# Altium project AirReader.PrjPcb
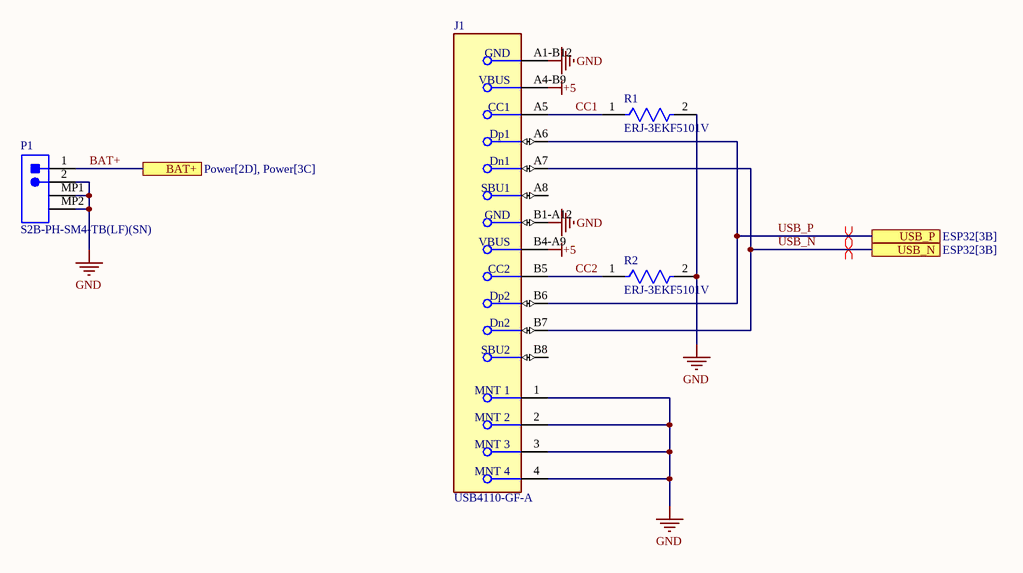
[diagram p0: Connectors.SchDoc]
5 sheets, 56 parts. Net scope: flat (ports and power ports of the same name join across sheets).
Board file: AirReader.PcbDoc
Sheets:
  Connectors.SchDoc
  PN532.SchDoc
  Power.SchDoc
  ESP32.SchDoc
  Peripherals.SchDoc

## Sheet Connectors.SchDoc
size A; SheetNumber: 1; SheetTotal: 5

### Parts
J1  USB4110-GF-A  [FP-USB4110-GF-A-MFG]
P1  S2B-PH-SM4-TB(LF)(SN)  [JST- S2B-PH-SM4-TB(LF)(SN)-2_V]
R1  ERJ-3EKF5101V  [FP-ERJ3EK-MFG]
R2  ERJ-3EKF5101V  [FP-ERJ3EK-MFG]

### Ports
BAT+ (see Power[2D], Power[3C]), USB_N (see ESP32[3B]), USB_P (see ESP32[3B])

### Nets
+5: J1.A4-B9(VBUS) J1.B4-A9(VBUS)
GND: J1.1(MNT_1) J1.2(MNT_2) J1.3(MNT_3) J1.4(MNT_4) J1.A1-B12(GND) J1.B1-A12(GND) P1.2 P1.MP1 P1.MP2 R1.2 R2.2
BAT+: P1.1 ; port BAT+
CC1: J1.A5(CC1) R1.1
CC2: J1.B5(CC2) R2.1
USB_N: J1.A7(Dn1) J1.B7(Dn2) ; port USB_N
USB_P: J1.A6(Dp1) J1.B6(Dp2) ; port USB_P

Not connected (* = marked no-connect by the designer): J1 A8(SBU1) B8(SBU2)

### Layout directives
differential pair: USB_N, USB_P

### Library data of the parts
J1 = CMP-245163-000002-1: CONN USB 2.0 TYPE-C R/A SMT; Manufacturer: GCT; Conn Orientation: Right Angle; Usb Standard: USB 2.0; Voltage Rating: 20V; Current Rating: 3/4.25/1.25/0.25A; Number Of Contacts: 16; Is Female: yes; Shielding: true; Standoff Height: 0.1mm; Octopart: https://octopart.com/usb4110-gf-a-gct-103941985; Temperature: -40°C to +85°C; RoHS: TRUE; Automotive: No; Contact Material: Gold,Nickel; Device Class L1: Connectors; Device Class L2: USB Connectors; Package: 0; Lead Free: Yes; ComponentLink2URL: https://gct.co/files/drawings/usb4110.pdf; Temperature Range High: +85°C; Temperature Range Low: -40°C; Height: 3.46mm; Manufacturer Part Number: USB4110-GF-A; ComponentLink2Description: Datasheet; Device Class L3: unset; Digikey Description: CONN USB 2.0 TYPE-C R/A SMT; Category: Conn
P1 = CMP-1755-00001-1: Male Header, Pitch 2 mm, 1 x 2 Position, Height 5.5 mm, -25 to 85 degC, RoHS, Tape and Reel; Current Rating: 3 A; ComponentLink1URL: http://www.jst.com/home2.html; Radiation Hardening: No; RoHSCompliant: True; Mount: Through Hole; Contact Material: Bronze; Package Quantity: 100; Width: 2.34 mm; DatasheetVersion: Dec-12; Height: 8.13 mm; Max Operating Temperature: 105degC; ComponentLink2Description: Datasheet; Lead Pitch: 0.1 inch; Contact Finish: Lead; Packaging: Bulk; Colour: Black; Contact Plating: Tin; Min Operating Temperature: -65degC; ComponentLink1Description: Manufacturer URL; PackageReference: S2B-PH-SM4-TB(LF)(SN)-2; PackageDescription: Male Header, Pitch 2 mm, 1 x 2 Position, Height 5.5 mm; ComponentLink2URL: http://www.jst-mfg.com/product/pdf/eng/ePH.pdf; Pins: 40; Length: 101.19 mm
R1 R2 = CMP-2000-00540-8: RES SMD 5.1K OHM 1% 1/10W 0603; Power Rating: 100mW; Temperature Coefficient: 100ppm/°C; Voltage Rating: 75V; Resistance: 5.1kR; Military Standard: Not; Case/Package: 0603; Packaging: Tape and Reel; Package Quantity: 1; Reach SVHC Compliant: Yes; Lead Free: Lead Free; Mount: Surface Mount; Size Code: 0603; Depth: 0.8mm; Resistance Tolerance: 1%; Number of Terminations: 2; Resistor Type: Thick Film; Width: 0.8mm; Construction: Rectangular; Series: ERJ; Radiation Hardening: No; Max Operating Temperature: 155°C; Features: Automotive AEC-Q200; Tolerance: 1%; Voltage Rating (DC): 75V; Length: 1.6mm; RoHS Compliant: Yes; Min Operating Temperature: -55°C; Case Code (Metric): 1608; Termination: SMD/SMT; Weight: 7.1E-05oz; Max Power Dissipation: 100mW; Contact Plating: Tin; Height: 0.022inch; Case Code (Imperial): 0603

## Sheet PN532.SchDoc
size A; SheetNumber: 2; SheetTotal: 5
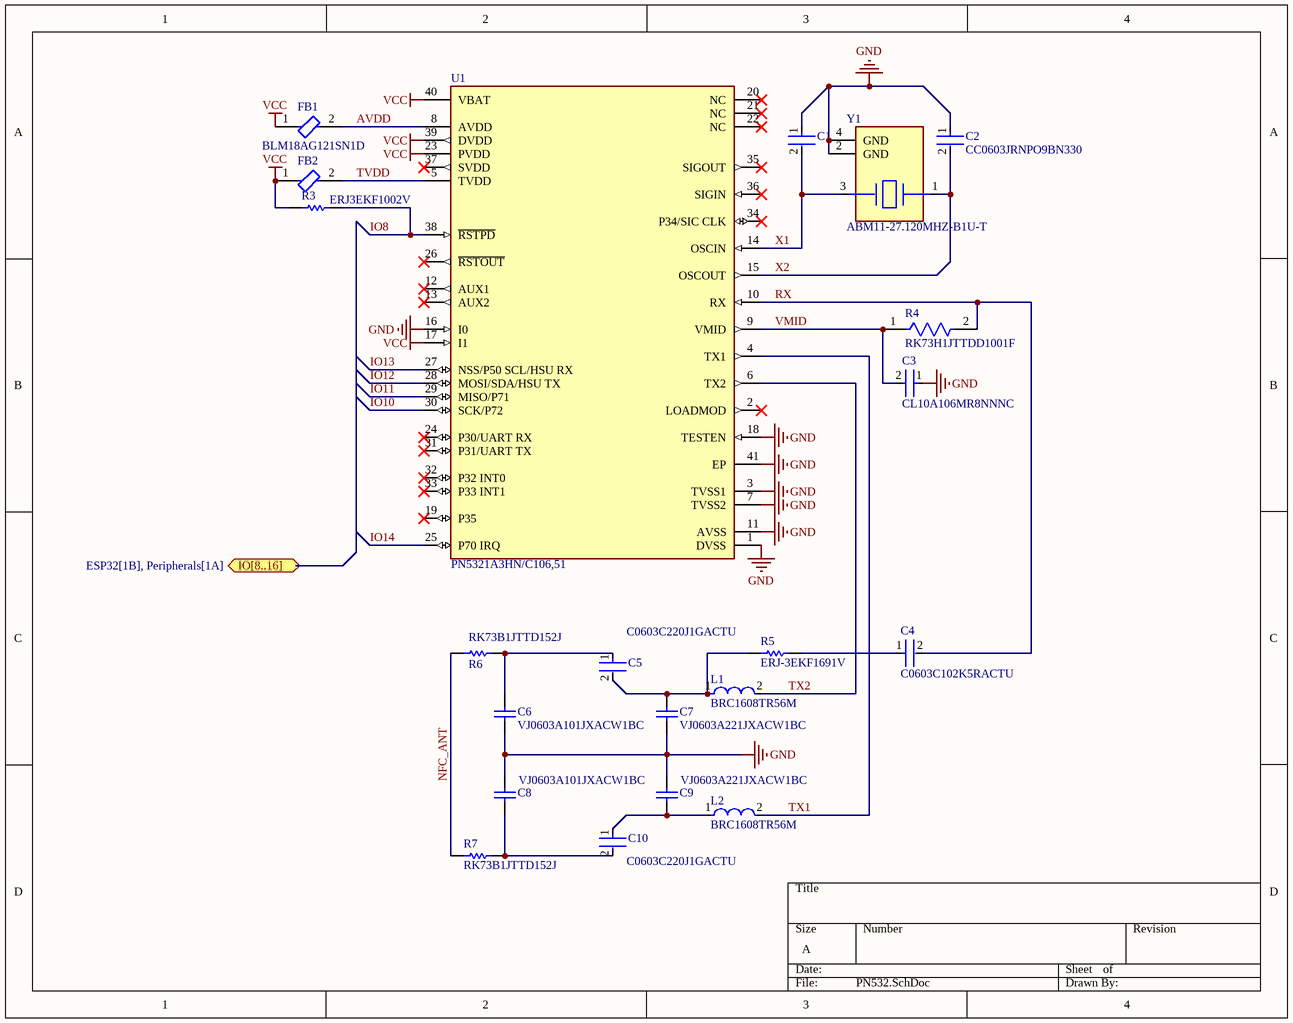
[diagram p1: PN532.SchDoc]

### Parts
C1  CC0603JRNPO9BN330  [FP-CC0603-0_9-IPC_C]  (value not drawn)
C2  CC0603JRNPO9BN330  [FP-CC0603-0_9-IPC_C]
C3  CL10A106MR8NNNC  [FP-CL10-IPC_C]
C4  C0603C102K5RACTU  [FP-C0603C-CF-MFG]
C5  C0603C220J1GACTU  [FP-C0603C-CF-MFG]
C6  VJ0603A101JXACW1BC  [CAPC1608X95X40ML15T15]
C7  VJ0603A221JXACW1BC  [CAPC1608X95X40ML15T15]
C8  VJ0603A101JXACW1BC  [CAPC1608X95X40ML15T15]
C9  VJ0603A221JXACW1BC  [CAPC1608X95X40ML15T15]
C10  C0603C220J1GACTU  [FP-C0603C-CF-MFG]
FB1  BLM18AG121SN1D  [FP-BLM18-0_15-t0_8-IPC_B]
FB2  BLM18AG121SN1D  [FP-BLM18-0_15-t0_8-IPC_B]  (value not drawn)
L1  BRC1608TR56M  [FP-BRC1608-MFG]
L2  BRC1608TR56M  [FP-BRC1608-MFG]
R3  ERJ3EKF1002V  [RESC1609X55X30LL15T15]
R4  RK73H1JTTDD1001F  [FP-RK73H1J-IPC_A]
R5  ERJ-3EKF1691V  [RESC1608X55X30NL15T15]
R6  RK73B1JTTD152J  [RESC1608X55X30LL20T10]
R7  RK73B1JTTD152J  [RESC1608X55X30LL20T10]
U1  PN5321A3HN/C106,51  [FP-SOT618-1-MFG]
Y1  ABM11-27.120MHZ-B1U-T  [FP-ABM11-MFG]

### Ports
IO[8..16] (bidir, see ESP32[1B], Peripherals[1A])

### Nets
GND: C1.1 C2.1 C3.1 C6.1 C7.1 C8.2 C9.2 U1.1(DVSS) U1.3(TVSS1) U1.7(TVSS2) U1.11(AVSS) U1.16(I0) U1.18(TESTEN) U1.41(EP) Y1.2(GND) Y1.4(GND)
VCC: FB1.1 FB2.1 R3.2 U1.17(I1) U1.23(PVDD) U1.39(DVDD) U1.40(VBAT)
AVDD: FB1.2 U1.8(AVDD)
IO8: R3.1 U1.38(~{RSTPD})
IO10: U1.30(SCK/P72)
IO11: U1.29(MISO/P71)
IO12: U1.28(MOSI/SDA/HSU_TX)
IO13: U1.27(NSS/P50_SCL/HSU_RX)
IO14: U1.25(P70_IRQ)
NFC_ANT: R6.1 R7.1
RX: C4.2 R4.2 U1.10(RX)
TVDD: FB2.2 U1.5(TVDD)
TX1: L2.2 U1.4(TX1)
TX2: L1.2 U1.6(TX2)
VMID: C3.2 R4.1 U1.9(VMID)
X1: C1.2 U1.14(OSCIN) Y1.3
X2: C2.2 U1.15(OSCOUT) Y1.1
NetC4_1: C4.1 R5.1
NetC5_1: C5.1 C6.2 R6.2
NetC5_2: C5.2 C7.2 L1.1 R5.2
NetC8_1: C8.1 C10.2 R7.2
NetC9_1: C9.1 C10.1 L2.1

Not connected (* = marked no-connect by the designer): U1 2(LOADMOD)* 12(AUX1)* 13(AUX2)* 19(P35)* 20(NC)* 21(NC)* 22(NC)* 24(P30/UART_RX)* 26(~{RSTOUT})* 31(P31/UART_TX)* 32(P32_INT0)* 33(P33_INT1)* 34(P34/SIC_CLK)* 35(SIGOUT)* 36(SIGIN)* 37(SVDD)*

### Library data of the parts
C1 C2 = CMP-2000-06072-2: CAP CER 33PF 50V C0G/NPO 0603; Tolerance: 5%; Temperature Coefficient: 30ppm/°C; Dielectric: C0G; Insulation Resistance: 100GR; Dielectric Material: Ceramic; Voltage Rating (DC): 50V; Capacitance: 33pF; Voltage: 50V; Resistor Type: Ceramic; Lead Free: Lead Free; Mount: Surface Mount; Case Code (Imperial): 0603; Min Operating Temperature: -55°C; Package Quantity: 1; Case Code (Metric): 1608; Radiation Hardening: No; Packaging: Tape and Reel; Length: 1.6mm; Width: 0.031inch; Termination: SMD/SMT; Max Operating Temperature: 125°C; Series: CC; Case/Package: 0603; RoHS Compliant: Yes; Number of Pins: 2; REACH SVHC: No SVHC; Thickness: 0.035inch; Depth: 0.8mm; Voltage Rating: 50V; Height: 0.8mm
C3 = CMP-13271-001990-1: Cap Ceramic 10uF 4V X5R ±20% Pad SMD 0603 +85°C T/R; Thickness: 0.035inch; Dielectric: X5R; Lead Free: Lead Free; Case Code (Imperial): 0603; Height: 0.8mm; Case Code (Metric): 1608; Voltage Rating (DC): 4V; Length: 1.6mm; Voltage Rating: 4V; Min Operating Temperature: -55°C; Depth: 0.8mm; Mount: Surface Mount; Radiation Hardening: No; Case/Package: 0603; Package Quantity: 1; Packaging: Tape and Reel; Width: 0.031inch; Tolerance: 20%; Max Operating Temperature: 85°C; Capacitance: 10uF
C4 = CMP-2006-03022-3: CAP CER 1000PF 50V X7R 0603; Manufacturer: KEMET; Automotive Grade: Grade 1; Tolerance: 0.1; Value: 1,000 pF; Temperature Coefficient: 30ppm/°C; Material: Ceramic; Temperature Characteristic: X7R; ComponentLink2URL: https://api.kemet.com/component-edge/download/datasheet/C0603C100J5GACAUTO.pdf; Temperature Range Low: -55°C; Capacitance: 1,000 pF; Device Class L2: Capacitors; Device Class L3: Ceramic Capacitors; Device Class L1: Passive Components; Temperature Range High: +125°C; Manufacturer Part Number: C0603C102K5RACTU; Digikey Description: CAP CER 1000PF 50V X7R 0603; Temperature: -55°C to +125°C; Voltage Rating: 50 V; Mouser Description: Capacitor; Ceramic; Cap; 1000pF; Tol 10%; SMT; Vol-Rtg 50V; X7R; Tape and Reel; Automotive: Yes; RoHS: TRUE; Octopart: https://octopart.com/c0603c102k5ractu-kemet-144878; Height: 0.87mm; Package: C0603C-CF; Lead Free: Yes; Category: Cap; ComponentLink2Description: Datasheet
C5 C10 = CMP-2006-03322-2: CAP CER 22PF 100V 5% NP0 0603; Manufacturer: KEMET; Material: Ceramic; Automotive Grade: Grade 1; Temperature Characteristic: C0G; Temperature Coefficient: 30ppm/°C; Tolerance: 0.05; Temperature Range High: +125°C; Capacitance: 22 pF; ComponentLink2URL: https://api.kemet.com/component-edge/download/datasheet/C0603C100J5GACAUTO.pdf; Package: C0603C-CF; Category: Cap; Voltage Rating: 100 V; Automotive: Yes; Mouser Description: Multilayer Ceramic Capacitors MLCC - SMD/SMT 100volts 22pF C0G 5%; Device Class L1: Passive Components; Device Class L3: Ceramic Capacitors; Temperature: -55°C to +125°C; Digikey Description: CAP CER 22PF 100V 5% NP0 0603; RoHS: TRUE; Value: 22 pF; ComponentLink2Description: Datasheet; Height: 0.87mm; Temperature Range Low: -55°C; Manufacturer Part Number: C0603C220J1GACTU; Device Class L2: Capacitors; Octopart: https://octopart.com/c0603c220j1gactu-kemet-9142653; Lead Free: Yes
C6 C8 = CMP-2006-01530-1: Manufacturer: Vitramon; Part Number: VJ0603A101JXACW1BC
C7 C9 = CMP-2006-00030-1: Manufacturer: Vitramon; Part Number: VJ0603A221JXACW1BC
FB1 FB2 = CMP-0686-00439-3: Chip Ferrite Bead, 0603, 120Ω @ 100MHz, 0.18Ω, 25%, 800mA; DC Resistance (DCR): 180mR; Number of Lines: 1; Current Rating: 500mA; Material: Steel; Impedance: 120R; Shielding: Unshielded; Case/Package: 0603; Max Operating Temperature: 125°C; Min Operating Temperature: -55°C; Series: BLM18A; Case Code (Metric): 1608; DC Resistance-Max: 180mR; Package Quantity: 1; Core Material: Ferrite; Radiation Hardening: No; Length: 1.6mm; Lead Free: Lead Free; Max DC Current: 500mA; Termination: SMD/SMT; Number of Pins: 2; Tolerance: 25%; Military Standard: Not; REACH SVHC: No SVHC; Number of Circuits: 1; Test Frequency: 100MHz; Max Current Rating: 500mA; Depth: 0.8mm; Frequency: 100MHz; Width: 0.8mm; Case Code (Imperial): 0603; DC Current: 500mA; Height: 0.8mm; RoHS Compliant: Yes; Packaging: Tape and Reel
L1 L2 = CMP-14484-000012-1: FIXED IND 560NH 760MA 95 MOHM; Tolerance: 20%; Shielding: Unshielded; Test Frequency: 7.96MHz; Self Resonant Frequency: 170MHz; DC Resistance (DCR): 95mR; Core Material: Ferrite; Saturation Current: 1.15A; Inductance Tolerance: 20%; Case Code (Imperial): 0603; Inductance: 560nH; Mount: Surface Mount; Min Operating Temperature: -40°C; Height - Seated (Max): 0.039inch; Halogen Free: Halogen Free; Radiation Hardening: No; REACH SVHC: No SVHC; Termination: SMD/SMT; Height: 0.8mm; Case/Package: 0603; Number of Pins: 2; Package Quantity: 3000; Packaging: Tape and Reel; Current Rating: 760mA; Military Standard: Not; Depth: 1mm; Max DC Current: 760mA; Composition: Wirewound; Max Operating Temperature: 105°C; Case Code (Metric): 1608; Length: 1.6mm; Width: 0.031inch; DC Current: 760mA
R3 = CMP-1012-00623-3: Chip Resistor, 10 KOhm, +/- 1%, 0.1 W, -55 to 155 degC, 0603 (1608 Metric), RoHS, Tape and Reel; Manufacturer: Panasonic; Voltage Rating: 75V; Case\/Package: 0603; Power Rating: 100mW; Resistance: 10KOhm; Temperature Coefficient: 100ppm\/degreesC; Number of Pins: 2; Package Reference: 603; Depth: 0.8mm; Mount: SurfaceMount; Package Description: 2-Pin Surface Mount Device, Body 1.6 x 0.85 mm; Datasheet Version: 02/2017; Length: 1.6mm; Lead Free: LeadFree; Height: 0.45mm; Number of Terminations: 2; Max Power Dissipation: 100mW; Min Operating Temperature: -55degC; Datasheet URL: https://industrial.panasonic.com/cdbs/www-data/pdf/RDA0000/AOA0000C304.pdf; Termination: SMD/SMT; Case Code (Metric): 1608; Case Code (Imperial): 0603; Tolerance: 1%; Max Operating Temperature: 155degC; RoHSCompliant: true; Voltage Rating (DC): 75V; Radiation Hardening: No; Packaging: TapeandReel; Composition: ThickFilm; Mounting Technology: SurfaceMount; Manufacturer URL: http://www.panasonic.com/; Width: 0.031inch; REACH SVHC: NoSVHC; Contact Plating: Tin; Military Standard: Not; Package Quantity: 1
R4 = CMP-2000-01750-2: 1kΩ ±1% 0.125W Chip Resistor 0603 Thick Film AEC-Q200 Qualified; Power Rating: 100mW; Temperature Coefficient: 100ppm/°C; Voltage Rating: 50V; Resistance: 1kR; Max Operating Temperature: 155°C; Min Operating Temperature: -55°C; Depth: 0.8mm; Case/Package: 0603; Length: 1.6mm; Package Quantity: 10000; Construction: Rectangular; Resistor Type: Thick Film; Lead Free: Lead Free; RoHS Compliant: Yes; Military Standard: Not; Case Code (Metric): 1608; Termination: SMD/SMT; Packaging: Tape and Reel; Tolerance: 1%; Width: 0.8mm; Series: RK73H; Case Code (Imperial): 0603; Height: 0.45mm
R5 = CMP-1012-00534-2: Manufacturer: Panasonic; Part Number: ERJ-3EKF1691V
R6 R7 = CMP-2000-01875-1: Manufacturer: KOA Speer; Part Number: RK73B1JTTD152J
U1 = CMP-10150-000009-1: IC RFID RDR/TRAN 13.56MZ 40HVQFN; Manufacturer: NXP Semiconductors; Max Power Dissipation: 500mW; Transmitting Current: 60mA; Data Rate: 424kbits/s; Max Junction Temp: +125°C; Standoff Height: 0mm; Nominal Supply Current: 0.5-60mA; Interface: I2C,SPI,UART; Number Of Adc Channels: 2; Max Frequency: 13.56MHz; Number Of Gpio: 9; Min Supply Voltage: 1.6V; Max Supply Voltage: 5.5V; RoHS: TRUE; Ambient Temperature Range High: +85°C; Temperature Range High: +125°C; Lead Free: Yes; Package: SOT618-1; Temperature Range Low: -40°C; Device Class L1: Integrated Circuits (ICs); Digikey Description: IC RFID RDR/TRAN 13.56MZ 40HVQFN; Octopart: https://octopart.com/pn5321a3hn%2Fc106%2C51-nxp+semiconductors-18453768; Device Class L3: Transceivers; Temperature: -40°C to +125°C; Ipc Land Pattern Name: QFN50P600X600X85-40; Device Class L2: RF Semiconductors and Devices; Footprint Url: https://www.nxp.com/docs/en/package-information/SOT618-1.pdf; Automotive: No; ComponentLink2Description: Datasheet; ComponentLink2URL: https://www.nxp.com/docs/en/nxp/data-sheets/PN532_C1.pdf; Category: IC; Height: 1mm; Mouser Description: PN5321A3HN Series 13.56 MHz RF Reader Analog and Digital Combo - HVQFN-40; Manufacturer Part Number: PN5321A3HN/C106,51; Ambient Temperature Range Low: -30°C
Y1 = CMP-27762-005978-1: Crystal 27.12MHz ±10ppm 10pF SMD-4 2mm x 1.6mm

## Sheet Power.SchDoc
size A; SheetNumber: 3; SheetTotal: 5
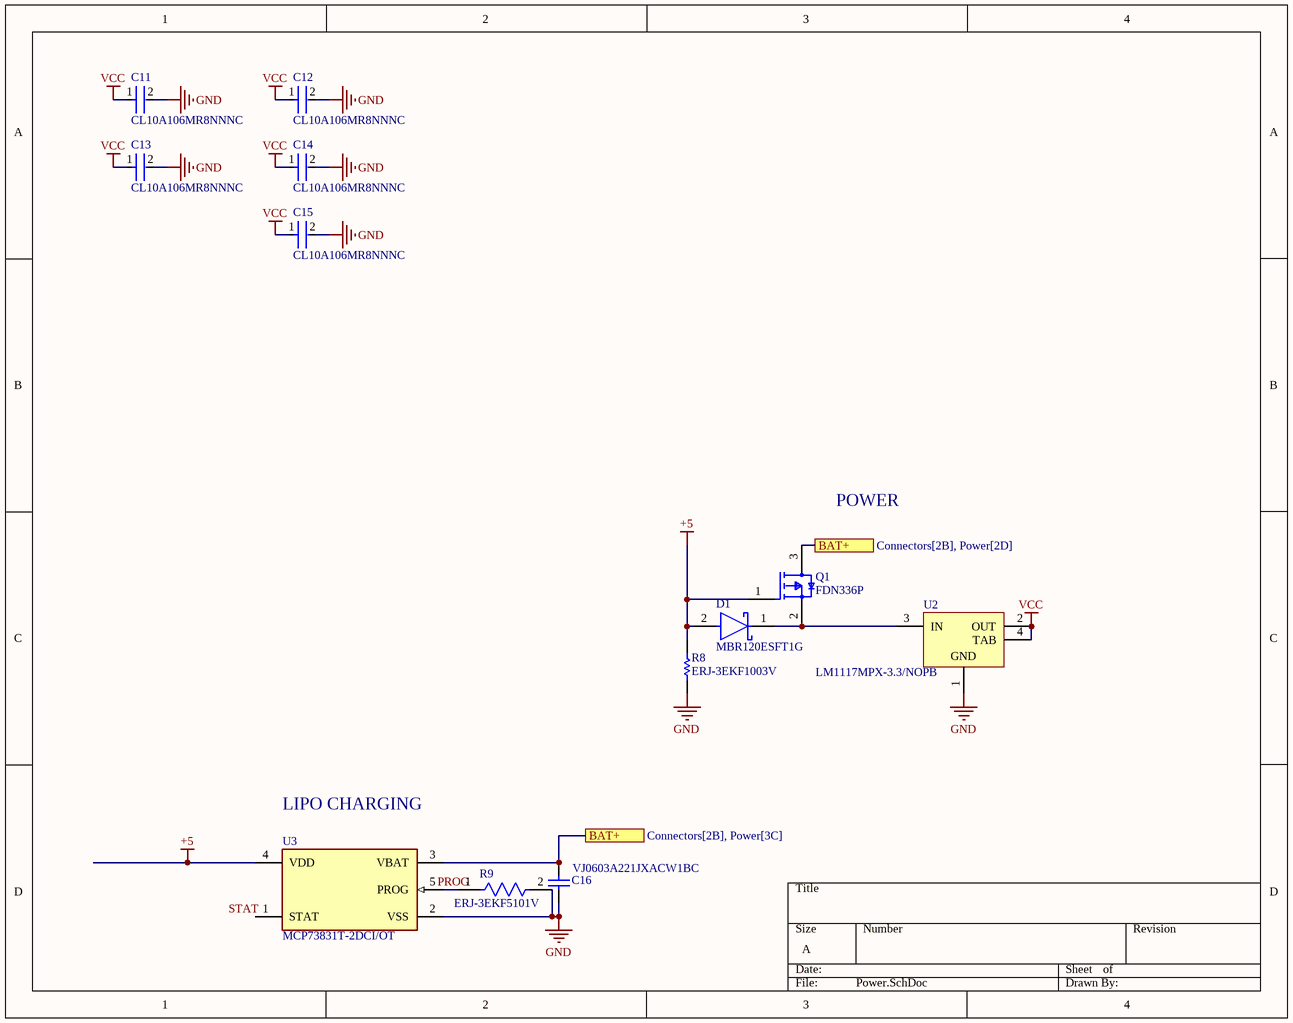
[diagram p2: Power.SchDoc]

### Parts
C11  CL10A106MR8NNNC  [FP-CL10-IPC_C]
C12  CL10A106MR8NNNC  [FP-CL10-IPC_C]
C13  CL10A106MR8NNNC  [FP-CL10-IPC_C]
C14  CL10A106MR8NNNC  [FP-CL10-IPC_C]
C15  CL10A106MR8NNNC  [FP-CL10-IPC_C]
C16  VJ0603A221JXACW1BC  [CAPC1608X95X40ML15T15]
D1  MBR120ESFT1G  [On_Semiconductor_498_MFG]
Q1  FDN336P  [FP-527AG-IPC_A]
R8  ERJ-3EKF1003V  [RESC1608X55X30ML15T15]
R9  ERJ-3EKF5101V  [FP-ERJ3EK-MFG]
U2  LM1117MPX-3.3/NOPB  [DCY0004A_L]
U3  MCP73831T-2DCI/OT  [FP-C04-091-OT-IPC_B]

### Ports
BAT+ (see Connectors[2B], Power[2D]), BAT+ (see Connectors[2B], Power[3C])

### Nets
+5: D1.2(A) Q1.1(G) R8.2 U3.4(VDD)
GND: C11.2 C12.2 C13.2 C14.2 C15.2 C16.1 R8.1 R9.2 U2.1(GND) U3.2(VSS)
VCC: C11.1 C12.1 C13.1 C14.1 C15.1 U2.2(OUT) U2.4(TAB)
BAT+: C16.2 Q1.3(D) U3.3(VBAT) ; port BAT+
NetD1_1: D1.1(C) Q1.2(S) U2.3(IN)
NetR9_1: R9.1 U3.5(PROG)

Not connected (* = marked no-connect by the designer): U3 1(STAT)

### Notes on the sheet
- POWER
- (near U3) LIPO CHARGING
- Labels drawn without touching a wire or pin: PROG, STAT

### Library data of the parts
C11-C15 = CMP-13271-001990-1: as C3 on sheet PN532; Thickness: 0.035inch; Dielectric: X5R; Lead Free: Lead Free; Case Code (Imperial): 0603; Height: 0.8mm; Case Code (Metric): 1608; Voltage Rating (DC): 4V; Length: 1.6mm; Voltage Rating: 4V; Min Operating Temperature: -55°C; Depth: 0.8mm; Mount: Surface Mount; Radiation Hardening: No; Case/Package: 0603; Package Quantity: 1; Packaging: Tape and Reel; Width: 0.031inch; Tolerance: 20%; Max Operating Temperature: 85°C; Capacitance: 10uF
C16 = CMP-2006-00030-1: Manufacturer: Vitramon; Part Number: VJ0603A221JXACW1BC
D1 = CMP-1055-00434-2: NexarPartId: 330787; Manufacturer Lifecycle Status: ACTIVE; Voltage Rating (DC): 20V; Max Forward Surge Current (Ifsm): 40A; Output Current: 1A; Max Junction Temperature (Tj): 150°C; Polarity: Standard; Peak Reverse Current: 10µA; Element Configuration: Single; Forward Voltage: 530mV; Lifecycle Status: Production; Packaging: Cut Tape; Lead Free: Lead Free; Radiation Hardening: No; Min Operating Temperature: -65°C; Average Rectified Current: 1A; Current Rating: 1A; Max Reverse Voltage (DC): 20V; RoHS: Compliant; REACH SVHC: No SVHC; Max Surge Current: 40A; Length: 2.9mm; Forward Current: 1A; Height: 880µm; Contact Plating: Tin; Width: 1.8mm; Reverse Voltage: 20V; Schedule B: 8541100080; Peak Non-Repetitive Surge Current: 40A; Max Operating Temperature: 150°C; Max Repetitive Reverse Voltage (Vrrm): 20V; Max Reverse Leakage Current: 10µA; Number of Pins: 2; Halogen Free: Halogen Free
Q1 = CMP-07173-000103-1: MOSFET P-CH 20V 1.3A SSOT3; Voltage Rating (DC): -20V; Element Configuration: Single; Threshold Voltage: -900mV; Current Rating: -1.3A; Rds On Max: 200mR; Turn-Off Delay Time: 16ns; Input Capacitance: 330pF; Max Power Dissipation: 500mW; Rise Time: 12ns; Turn-On Delay Time: 7ns; Number of Elements: 1; Gate to Source Voltage (Vgs): 8V; Width: 1.4mm; Lead Free: Lead Free; Length: 2.92mm; Max Operating Temperature: 150°C; Mount: Surface Mount; Contact Plating: Tin; Radiation Hardening: No; Case/Package: TO-236-3; Weight: 0.03g; Drain to Source Breakdown Voltage: -20V; Continuous Drain Current (ID): 1.3A; Min Operating Temperature: -55°C; On-State Resistance: 200mR; Drain to Source Voltage (Vdss): 20V; Fall Time: 12ns; Drain to Source Resistance: 200mR; Package Quantity: 1; Power Dissipation: 500mW; Nominal Vgs: -900mV; Termination: SMD/SMT; Packaging: Tape and Reel; Number of Pins: 3; Dual Supply Voltage: -20V; REACH SVHC: No SVHC; Height: 0.94mm
R8 = CMP-2000-00182-1: Manufacturer: Panasonic; Part Number: ERJ-3EKF1003V
R9 = CMP-2000-00540-8: as R1 on sheet Connectors; Military Standard: Not; Case/Package: 0603; Packaging: Tape and Reel; Package Quantity: 1; Reach SVHC Compliant: Yes; Lead Free: Lead Free; Mount: Surface Mount; Size Code: 0603; Depth: 0.8mm; Resistance Tolerance: 1%; Number of Terminations: 2; Resistor Type: Thick Film; Width: 0.8mm; Construction: Rectangular; Series: ERJ; Radiation Hardening: No; Max Operating Temperature: 155°C; Features: Automotive AEC-Q200; Tolerance: 1%; Voltage Rating (DC): 75V; Length: 1.6mm; RoHS Compliant: Yes; Min Operating Temperature: -55°C; Case Code (Metric): 1608; Termination: SMD/SMT; Weight: 7.1E-05oz; Max Power Dissipation: 100mW; Contact Plating: Tin; Height: 0.022inch; Case Code (Imperial): 0603
U2 = CMP-0062-01639-4: 800mA Low-Dropout Linear Regulator, 4-pin SOT-223, Pb-Free; Manufacturer: Texas Instruments; High-Reliability: Y; PowerWise: N; PackageTopMarking: XYTT*N05A; CompType: LDO IC; ComponentLink1URL: http://www.ti.com/general/docs/lit/getliterature.tsp?genericPartNumber=LM1117-N&fileType=pdf; PartNumber: LM1117MPX-3.3/NOPB; ComponentLink1Description: Datasheet URL; PinCount: 4; Code_JEDEC: TO-261-AA; PackageDescription: Molded SOT-223, 6.50 x 3.56 x 1.6mm Body, 4 Lead, 2.3mm Pitch; PackageReference: DCY0004A; RoHS: Y; Code_IPC: SOT223-4
U3 = CMP-0133-00146-2: IC CONTROLLR LI-ION 4.2V SOT23-5; Max Charge Current: 500mA; Min Output Voltage: 4.168V; Max Supply Voltage: 6V; Max Output Voltage: 4.232V; Number of Cells: 1; Operating Supply Current: 510uA; Min Supply Voltage: 3.75V; Max Output Current: 500mA; Case/Package: SOT-23; Radiation Hardening: No; REACH SVHC: No SVHC; Package Quantity: 3000; Output Current: 500mA; Number of Channels: 1; Output Voltage: 4.2V; Max Operating Temperature: 85°C; Number of Pins: 5; Mount: Surface Mount; Length: 3.1mm; Contact Plating: Tin; Packaging: Tape and Reel; Width: 1.8mm; Min Operating Temperature: -40°C; Max Input Voltage: 3.75V; Height: 1.3mm; Lead Free: Lead Free

## Sheet ESP32.SchDoc
size A; SheetNumber: 4; SheetTotal: 5
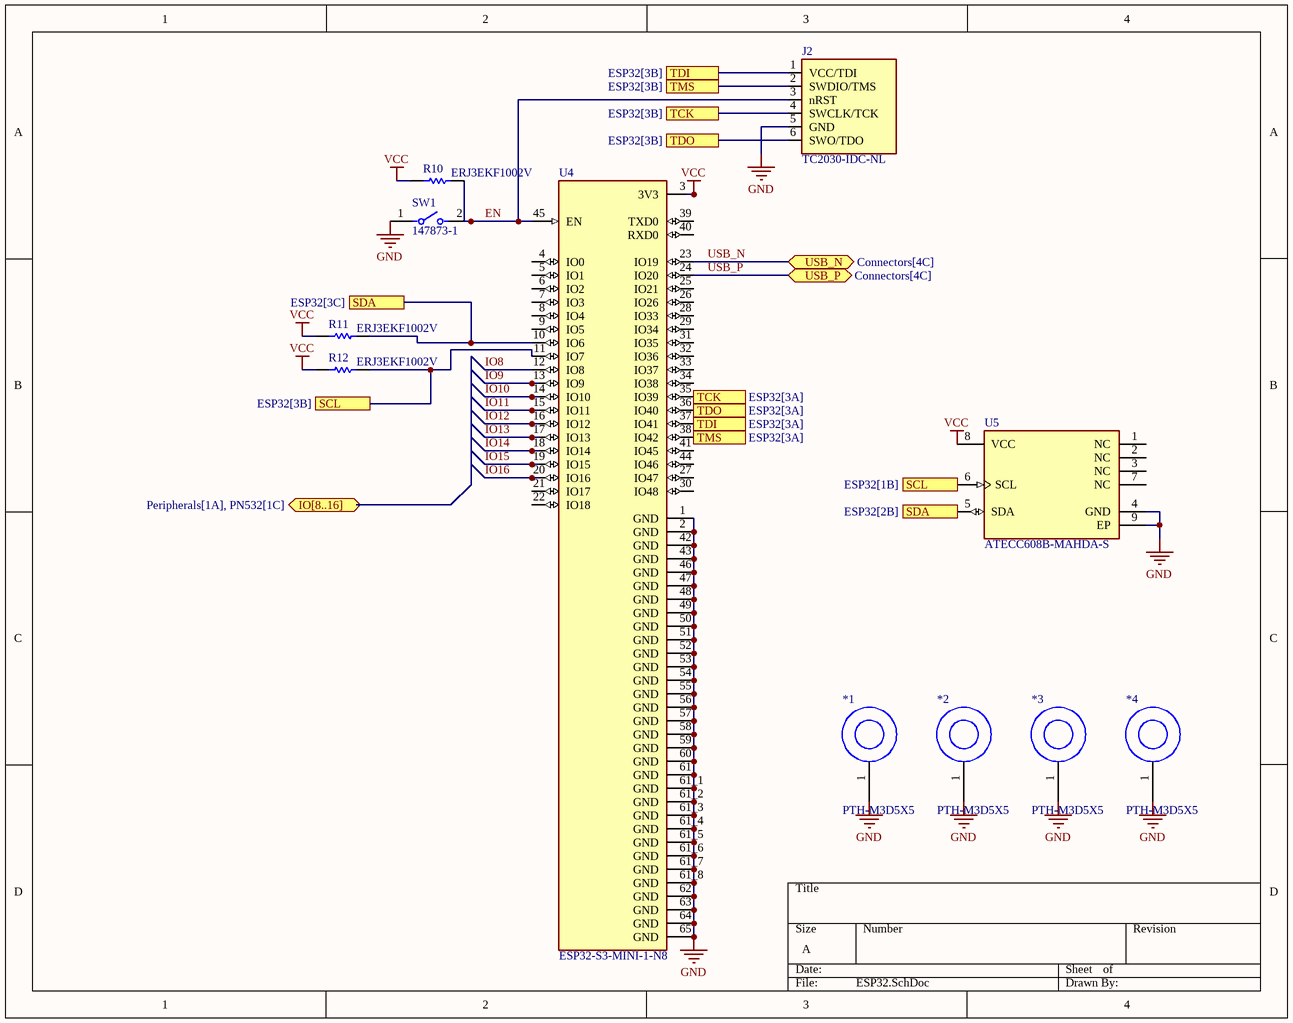
[diagram p3: ESP32.SchDoc]

### Parts
*1  PTH-M3D5X5  [PTH-M3D5X5-Footprint-1]
*2  PTH-M3D5X5  [PTH-M3D5X5-Footprint-1]
*3  PTH-M3D5X5  [PTH-M3D5X5-Footprint-1]
*4  PTH-M3D5X5  [PTH-M3D5X5-Footprint-1]
J2  TC2030-IDC-NL  [TAG_TC2030-IDC-NL]
R10  ERJ3EKF1002V  [RESC1609X55X30LL15T15]
R11  ERJ3EKF1002V  [RESC1609X55X30LL15T15]
R12  ERJ3EKF1002V  [RESC1609X55X30LL15T15]
SW1  147873-1  [FP-147873-1-MFG]
U4  ESP32-S3-MINI-1-N8  [XCVR_ESP32-S3-MINI-1-N8]
U5  ATECC608B-MAHDA-S  [FP-C04-21355-Q4B-IPC_B]

### Ports
IO[8..16] (bidir, see Peripherals[1A], PN532[1C]), SCL (see ESP32[1B]), SCL (see ESP32[3B]), SDA (see ESP32[2B]), SDA (see ESP32[3C]), TCK (see ESP32[3A]), TCK (see ESP32[3B]), TDI (see ESP32[3A]), TDI (see ESP32[3B]), TDO (see ESP32[3A]), TDO (see ESP32[3B]), TMS (see ESP32[3A]), TMS (see ESP32[3B]), USB_N (bidir, see Connectors[4C]), USB_P (bidir, see Connectors[4C])

### Nets
GND: *1.1 *2.1 *3.1 *4.1 J2.5(GND) SW1.1 U4.1(GND) U4.2(GND) U4.42(GND) U4.43(GND) U4.46(GND) U4.47(GND) U4.48(GND) U4.49(GND) U4.50(GND) U4.51(GND) U4.52(GND) U4.53(GND) U4.54(GND) U4.55(GND) U4.56(GND) U4.57(GND) U4.58(GND) U4.59(GND) U4.60(GND) U4.61(GND) U4.61_1(GND) U4.61_2(GND) U4.61_3(GND) U4.61_4(GND) U4.61_5(GND) U4.61_6(GND) U4.61_7(GND) U4.61_8(GND) U4.62(GND) U4.63(GND) U4.64(GND) U4.65(GND) U5.4(GND) U5.9(EP)
VCC: R10.2 R11.2 R12.2 U4.3(3V3) U5.8(VCC)
EN: J2.3(nRST) R10.1 SW1.2 U4.45(EN)
IO8: U4.12(IO8)
IO9: U4.13(IO9)
IO10: U4.14(IO10)
IO11: U4.15(IO11)
IO12: U4.16(IO12)
IO13: U4.17(IO13)
IO14: U4.18(IO14)
IO15: U4.19(IO15)
IO16: U4.20(IO16)
USB_N: U4.23(IO19) ; port USB_N
USB_P: U4.24(IO20) ; port USB_P
NetJ2_1: J2.1(VCC/TDI) U4.37(IO41) ; port TDI
NetJ2_2: J2.2(SWDIO/TMS) U4.38(IO42) ; port TMS
NetJ2_4: J2.4(SWCLK/TCK) U4.35(IO39) ; port TCK
NetJ2_6: J2.6(SWO/TDO) U4.36(IO40) ; port TDO
NetR11_1: R11.1 U4.10(IO6) U5.5(SDA) ; port SDA
NetR12_1: R12.1 U4.11(IO7) U5.6(SCL) ; port SCL

Not connected (* = marked no-connect by the designer): U4 4(IO0) 5(IO1) 6(IO2) 7(IO3) 8(IO4) 9(IO5) 21(IO17) 22(IO18) 25(IO21) 26(IO26) 27(IO47) 28(IO33) 29(IO34) 30(IO48) 31(IO35) 32(IO36) 33(IO37) 34(IO38) 39(TXD0) 40(RXD0) 41(IO45) 44(IO46); U5 1(NC) 2(NC) 3(NC) 7(NC)

### Library data of the parts
*1-*4 = CMP-010-00024-1: Plated Thru-Hole M3 D5X5; Pins: 1; Mounting Technology: TH
J2 = CMP-070-000001-2: CABLE ADAPTER 6 POS; Package: None; Price: None; Pin Count: 6; Component Type: Standard; Availability: Unavailable; MP: TC2030-IDC-NL; Design Item ID: TC2030-IDC-NL; Value: *; Source: TC2030-IDC-NL.SchLib
R10-R12 = CMP-1012-00623-3: as R3 on sheet PN532; Number of Pins: 2; Package Reference: 603; Depth: 0.8mm; Mount: SurfaceMount; Package Description: 2-Pin Surface Mount Device, Body 1.6 x 0.85 mm; Datasheet Version: 02/2017; Length: 1.6mm; Lead Free: LeadFree; Height: 0.45mm; Number of Terminations: 2; Max Power Dissipation: 100mW; Min Operating Temperature: -55degC; Datasheet URL: https://industrial.panasonic.com/cdbs/www-data/pdf/RDA0000/AOA0000C304.pdf; Termination: SMD/SMT; Case Code (Metric): 1608; Case Code (Imperial): 0603; Tolerance: 1%; Max Operating Temperature: 155degC; RoHSCompliant: true; Voltage Rating (DC): 75V; Radiation Hardening: No; Packaging: TapeandReel; Composition: ThickFilm; Mounting Technology: SurfaceMount; Manufacturer URL: http://www.panasonic.com/; Width: 0.031inch; REACH SVHC: NoSVHC; Contact Plating: Tin; Military Standard: Not; Package Quantity: 1
SW1 = CMP-03407-000005-1: SWITCH TACTILE SPST-NO 0.05A 24V; Manufacturer: TE Connectivity; Contact Resistance: 100mΩ; Operating Force: 180gf; Electromechanical Life: 40000Cycles; Contact Current Rating: 50mA; Throw Configuration: SPST-NO; Mouser Description: Switch Tactile OFF (ON) SPST Rectangular Button J-Bend 0.05A 24VDC 1.77N SMD T/R; Mount: Surface Mount; Height: 5.5mm; Category: Switch; RoHS: TRUE; Temperature Range High: +85°C; ComponentLink2Description: Datasheet; Temperature Range Low: -35°C; Device Class L1: Electromechanical; Device Class L2: Switches; Package: 0; Temperature: -35°C to +85°C; Device Class L3: Tactile Switches; Automotive: No; Manufacturer Part Number: 147873-1; ComponentLink2URL: https://www.te.com/commerce/DocumentDelivery/DDEController?Action=showdoc&DocId=Customer+Drawing%7F147873%7FK3%7Fpdf%7FEnglish%7FENG_CD_147873_K3.pdf%7F147873-1; Lead Free: Yes; Voltage Rating Dc: 24V; Octopart: https://octopart.com/147873-1-te+connectivity-40818451; Digikey Description: SWITCH TACTILE SPST-NO 0.05A 24V
U4 = ESP32-S3-MINI-1-N8: Bluetooth, WiFi 802.11b/g/n, Bluetooth v5.0 Transceiver Module 2.4GHz PCB Trace Surface Mount; MF: {'manufacturer': u'Espressif Systems'}; Package: None; Price: None; Value: *; MP: ESP32-S3-MINI-1-N8; Availability: Unavailable
U5 = CMP-06260-000008-1: IC AUTHENTICATION CHIP

## Sheet Peripherals.SchDoc
size A; SheetNumber: 5; SheetTotal: 5
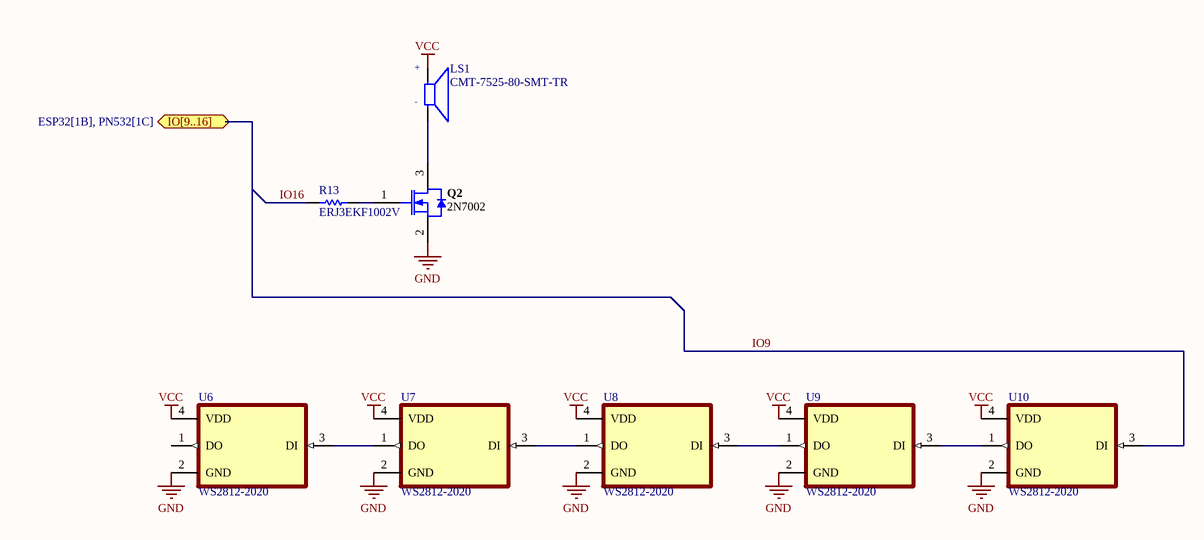
[diagram p4: Peripherals.SchDoc]

### Parts
LS1  CMT-7525-80-SMT-TR  [XDCR_CMT-7525-80-SMT-TR]
Q2  2N7002  [INF-PG-SOT23_M]
R13  ERJ3EKF1002V  [RESC1609X55X30LL15T15]
U6  WS2812-2020  [LED_WS2812-2020]
U7  WS2812-2020  [LED_WS2812-2020]
U8  WS2812-2020  [LED_WS2812-2020]
U9  WS2812-2020  [LED_WS2812-2020]
U10  WS2812-2020  [LED_WS2812-2020]

### Ports
IO[9..16] (bidir, see ESP32[1B], PN532[1C])

### Nets
GND: Q2.2(SOURCE) U6.2(GND) U7.2(GND) U8.2(GND) U9.2(GND) U10.2(GND)
VCC: LS1.P U6.4(VDD) U7.4(VDD) U8.4(VDD) U9.4(VDD) U10.4(VDD)
IO9: U10.3(DI)
IO16: R13.1
NetLS1_N: LS1.N Q2.3(DRAIN)
NetQ2_1: Q2.1(GATE) R13.2
NetU6_3: U6.3(DI) U7.1(DO)
NetU7_3: U7.3(DI) U8.1(DO)
NetU8_3: U8.3(DI) U9.1(DO)
NetU9_3: U9.3(DI) U10.1(DO)

Not connected (* = marked no-connect by the designer): U6 1(DO)

### Notes on the sheet
- (in symbol CMT-7525-80-SMT-TR) +; -

### Library data of the parts
LS1 = CMT-7525-80-SMT-TR: MF: {'manufacturer': u'CUI Devices'}; Package: None; Price: None; Value: *; MP: CMT-7525-80-SMT-TR; Availability: Unavailable
Q2 = CMP-1149-00026-1: N-Channel OptiMOS Small-Signal-Transistor, 60 V VDS, 0.3 A ID, -55 to 150 degC, PG-SOT23, Reel, Green; Manufacturer: Infineon; RDS (on) (max) (@4.5V): 4,000 mOhm; VDS (max): 60 V; IDpuls (max): 1.2Â A; QG: 0.4Â nC; RDS (on) (max): 3,000 mOhm; RthJA (max): 250 K/W; ID (max): 0.3Â A; VGS(th) (max): 2.5Â V; VGS(th) (min): 1.5Â V; Green: TRUE; Ptot (max): 0.5Â W; PackageDescription: 3-Pin Small Outline Transistor Package, 2.9 x 1.3 mm Body, 0.95 mm Pitch; Halogen-free: TRUE; ComponentLink2Description: Datasheet; ComponentLink1URL: http://www.infineon.com/; Packing: Reel; DatasheetVersion: Rev. 2.4; PartNumber: 2N7002; PackageReference: PG-SOT23; PackageVersion: Apr-08; ComponentLink3URL: http://www.infineon.com/dgdl/SOT23-Package_Overview.pdf?folderId=db3a30431936bc4b0119532290053c66&fileId=db3a30431936bc4b0119533468123c85; ComponentLink1Description: Manufacturer URL; Mounting Technology: Surface Mount; ComponentLink3Description: Package Specification; ComponentLink2URL: http://www.infineon.com/dgdl/2N7002_Rev2.4.pdf?folderId=db3a3043156fd573011622e10b5c1f67&fileId=db3a304319bc939a0119c2a9461e79e6
R13 = CMP-1012-00623-3: as R3 on sheet PN532; Number of Pins: 2; Package Reference: 603; Depth: 0.8mm; Mount: SurfaceMount; Package Description: 2-Pin Surface Mount Device, Body 1.6 x 0.85 mm; Datasheet Version: 02/2017; Length: 1.6mm; Lead Free: LeadFree; Height: 0.45mm; Number of Terminations: 2; Max Power Dissipation: 100mW; Min Operating Temperature: -55degC; Datasheet URL: https://industrial.panasonic.com/cdbs/www-data/pdf/RDA0000/AOA0000C304.pdf; Termination: SMD/SMT; Case Code (Metric): 1608; Case Code (Imperial): 0603; Tolerance: 1%; Max Operating Temperature: 155degC; RoHSCompliant: true; Voltage Rating (DC): 75V; Radiation Hardening: No; Packaging: TapeandReel; Composition: ThickFilm; Mounting Technology: SurfaceMount; Manufacturer URL: http://www.panasonic.com/; Width: 0.031inch; REACH SVHC: NoSVHC; Contact Plating: Tin; Military Standard: Not; Package Quantity: 1
U6-U10 = WS2812-2020: MF: {'manufacturer': u'Worldsemi'}; Package: None; Price: None; Value: *; MP: WS2812-2020; Availability: Unavailable

## Nets that join several sheets
+5: Connectors (J1.A4-B9 J1.B4-A9), Power (D1.2 Q1.1 R8.2 U3.4)
GND: Connectors (11 pins), PN532 (16 pins), Power (10 pins), ESP32 (40 pins), Peripherals (6 pins)
VCC: PN532 (7 pins), Power (7 pins), ESP32 (5 pins), Peripherals (6 pins)
BAT+: Connectors (P1.1), Power (C16.2 Q1.3 U3.3)
USB_N: Connectors (J1.A7 J1.B7), ESP32 (U4.23)
USB_P: Connectors (J1.A6 J1.B6), ESP32 (U4.24)